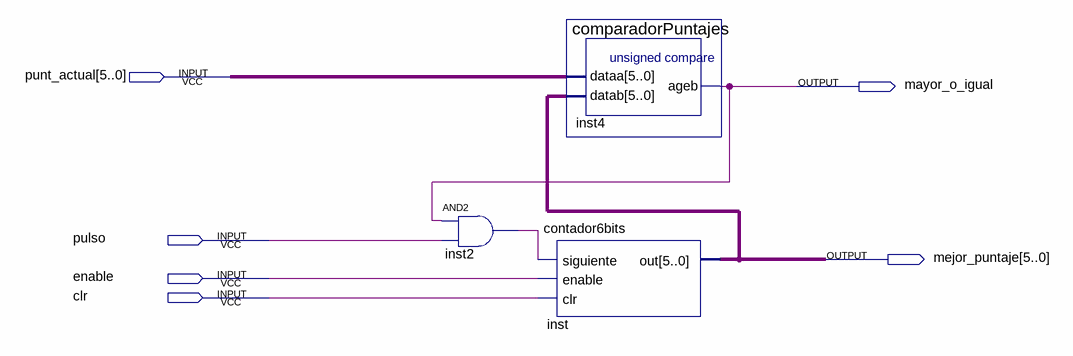
[diagram p0: schematic sheet]
// Quartus schematic guardar_ganador.bdf as structural Verilog: 3 symbols, 6 pins
module guardar_ganador (
  input  [5:0] punt_actual,
  input  pulso,
  input  enable,
  input  clr,
  output mayor_o_igual,
  output [5:0] mejor_puntaje
);

  wire inst2_out;

  and inst2 (inst2_out, mayor_o_igual, pulso);
  comparadorPuntajes inst4 (.dataa(punt_actual), .datab(mejor_puntaje), .ageb(mayor_o_igual));
  contador6bits inst (.siguiente(inst2_out), .enable(enable), .clr(clr), .out(mejor_puntaje));
endmodule
